# EAGLE design BatteryProtection (EAGLE 9.6.2)
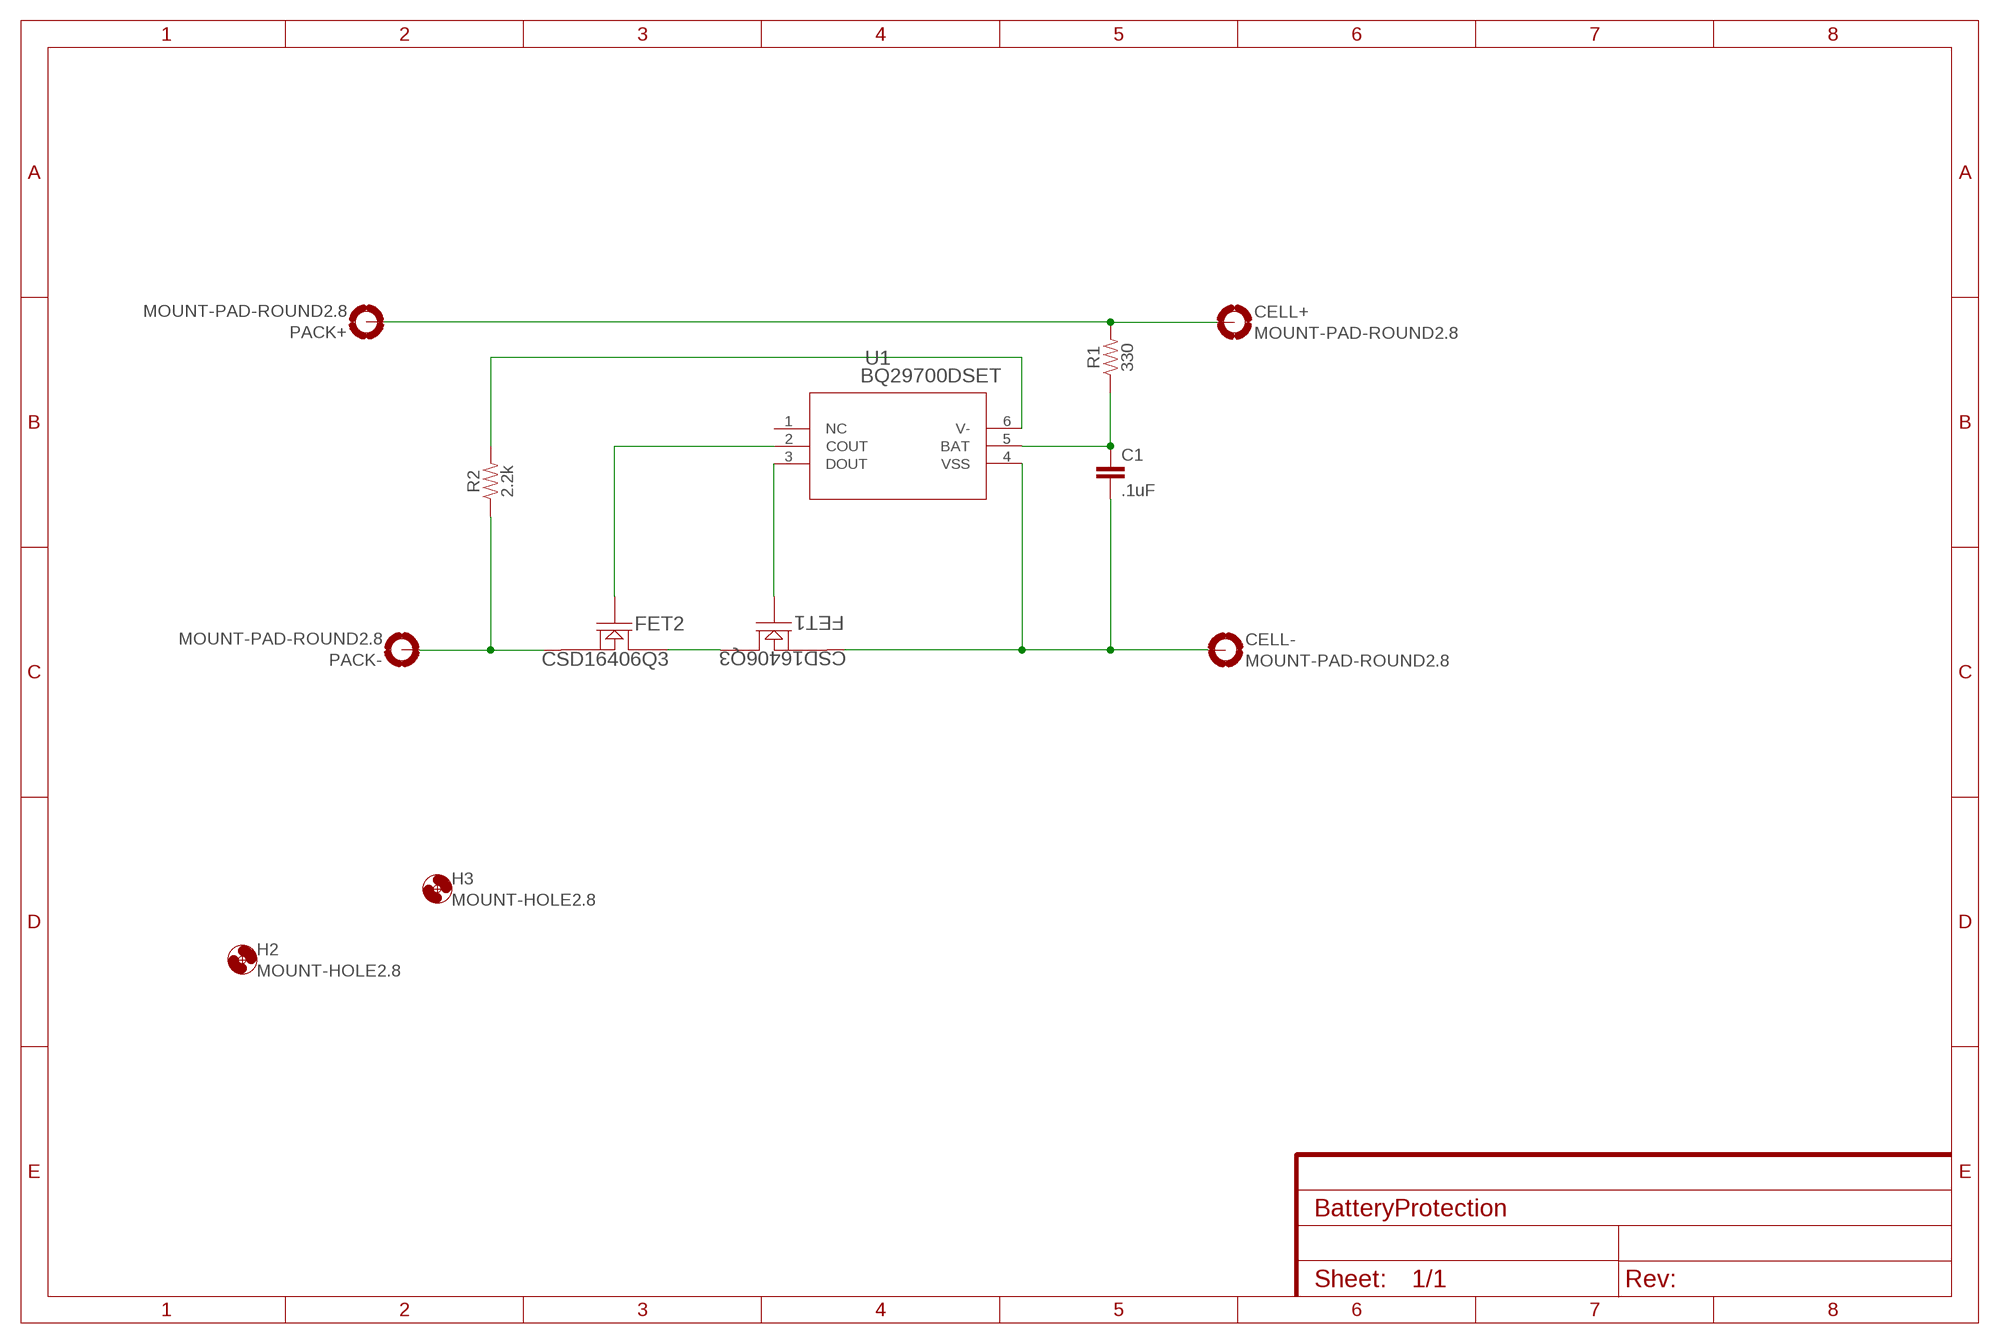
[diagram p0: schematic, sheet 1]

## Parts
C1  .1uF  0.33UF/330NF-0805-50V-10%  [0805]
CELL+  MOUNT-PAD-ROUND2.8  [2,8-PAD]
CELL-  MOUNT-PAD-ROUND2.8  [2,8-PAD]
FET1  CSD16406Q3  [DQG0008A]
FET2  CSD16406Q3  [DQG0008A]
H2  MOUNT-HOLE2.8  [2,8]
H3  MOUNT-HOLE2.8  [2,8]
PACK+  MOUNT-PAD-ROUND2.8  [2,8-PAD]
PACK-  MOUNT-PAD-ROUND2.8  [2,8-PAD]
R1  330  33KOHM-0603-1/10W-1%  [0603]
R2  2.2k  33KOHM-0603-1/10W-1%  [0603]
U1  BQ29700DSET  [DSE6]

## Nets
N$1: C1.1 R1.1 U1.5(BAT)
N$2: FET2.4(GATE) U1.2(COUT)
N$3: C1.2 CELL-.B2,8(MOUNT) FET1.1(SOURCE) U1.4(VSS)
N$4: FET1.5(DRAIN_2) FET2.5(DRAIN_2)
N$5: FET1.4(GATE) U1.3(DOUT)
N$6: R2.2 U1.6(V-)
N$7: CELL+.B2,8(MOUNT) PACK+.B2,8(MOUNT) R1.2
N$8: FET2.1(SOURCE) PACK-.B2,8(MOUNT) R2.1
Unconnected: U1.1(NC)

## Library data of the parts
C1 = SparkFun-Capacitors:0.33UF/330NF: 0.33µF/330nF ceramic capacitors A capacitor is a passive two-terminal electrical component used to store electrical energy temporarily in an electric field.; PROD_ID: CAP-08469; VALUE: 0.33µF
CELL+ CELL- PACK+ PACK- = holes:MOUNT-PAD-ROUND: MOUNTING PAD, round
FET1 FET2 = KRUPS:CSD16406Q3; DATASHEET_URL: http://www.ti.com/lit/ds/symlink/csd16406q3.pdf; IDSMAX: 60.0; MANUFACTURER_PART_NUMBER: CSD16406Q3; QGTYP: 5.8; QUANTITY: 1; RDSON45: 0.0059; VDSMAX: 25.0; VENDOR: Texas Instruments
H2 H3 = holes:MOUNT-HOLE: MOUNTING HOLE with drill center marker
R1 R2 = SparkFun-Resistors:33KOHM: 33kΩ resistor A resistor is a passive two-terminal electrical component that implements electrical resistance as a circuit element. Resistors act to reduce current flow, and, at the same time, act to lower voltage levels within circuits. - Wikipedia; PROD_ID: RES-08416; VALUE: 33k
U1 = KRUPS:BQ29700DSET; BUILT_BY: EMA_UL_Team; MANUFACTURER_PART_NUMBER: BQ29700DSET; VENDOR: Texas Instruments

## Board
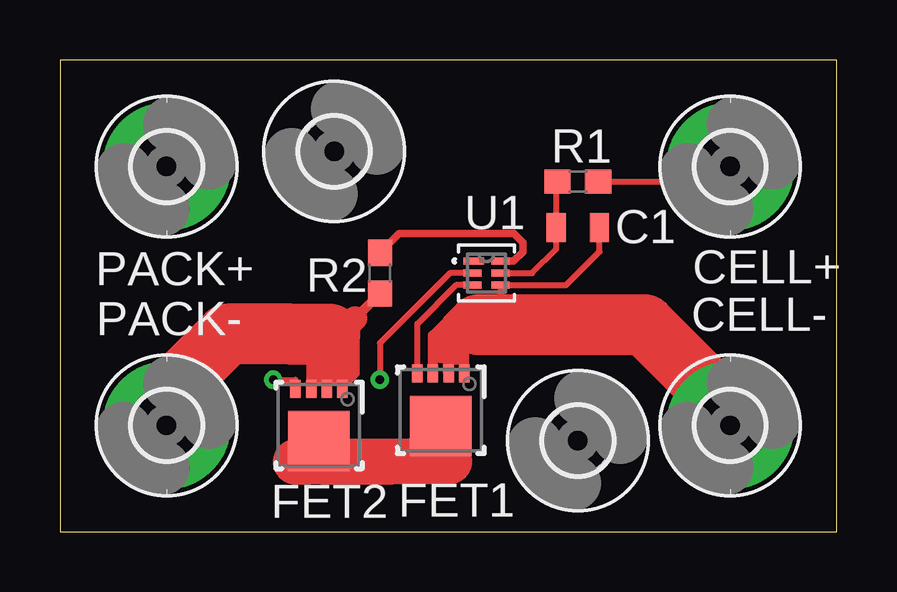
[diagram p1: board, top side]
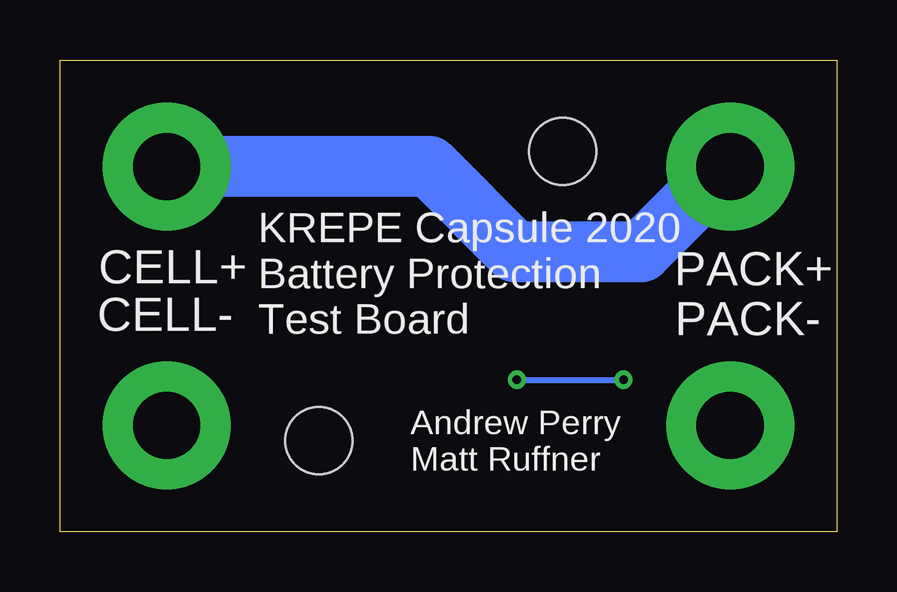
[diagram p2: board, bottom side, seen from below]

Size 32.38 x 19.68 mm. Coordinates in mm from the lower left corner, seen from the top.
Outline: 0,0 32.38,0 32.38,19.68 0,19.68 0,0
Copper layers (1*16): Top 0.035mm / dielectric 1.5mm / Bottom 0.035mm
Design rules "default *": minimum track width 6mil, minimum drill 0.35mm, track to track 6mil, track to pad 6mil, pad to pad 6mil, via to via 6mil, smd to smd 6mil, copper to edge 40mil, drill to drill 6mil, minimum pad ring 10mil, minimum via ring 8mil, stop-mask expansion 4mil, vias tented up to drill 14mil, thermal gap 10mil

### Footprints (pad centres in the part's own frame; a part is rotated, then mirrored left to right if it is on the bottom)
0805 = smd 0.8 x 1.2: 1 -0.9,0; 2 0.9,0
2,8-PAD = drill 2.8 pad 5.334: B2,8 0,0
DQG0008A = smd 0.75 x 0.44: 1 -1.525,0.975; 2 -1.525,0.325; 3 -1.525,-0.325; 4 -1.525,-0.975; 5 1.525,-0.975; 6 1.525,-0.325; 7 1.525,0.325; 8 1.525,0.975 | smd 2.5 x 2.55: 9 0.65,0 | smd 0.5 x 0.5: V 0.226,0.975
2,8 = hole 2.8: 0,0
0603 = smd 1.1 x 1: 1 -0.85,0; 2 0.85,0
DSE6 = smd 0.85 x 0.28: 1 -0.525,0.5 | smd 0.75 x 0.28: 2 -0.575,0; 3 -0.575,-0.5; 4 0.575,-0.5; 5 0.575,0; 6 0.575,0.5

### Placement (x,y rotation side)
C1  21.59,12.7 0 top
CELL+  27.94,15.24 0 top
CELL-  27.94,4.45 0 top
FET1  15.88,5.08 270 top
FET2  10.79,4.45 270 top
H2  11.43,15.88 0 top
H3  21.59,3.81 0 top
PACK+  4.45,15.24 0 top
PACK-  4.45,4.45 0 top
R1  21.59,14.61 0 top
R2  13.34,10.79 90 top
U1  17.78,10.79 0 top

### Tracks (layer width: path | path; a pad name or v marks a point on that pad's centre or on a via)
N$1
  Top 0.254: U1.5 19.68,10.79 20.69,11.8 C1.1 20.69,14.55 R1.1
  Top 0.305: 20.95,12.33 20.95,12.44 C1.1
N$2  (via drill 0.35)
  Top 0.254: U1.2 16.26,10.79 13.34,7.87 v13.34,6.35 | v8.89,6.35 9.82,6.35 FET2.4
  Bottom 0.254: v13.34,6.35 v8.89,6.35
N$3
  Top 0.254: C1.2 22.49,11.7 21.09,10.29 U1.4 18.36,9.54 17.45,8.64
  Top 0.406: 17.45,8.64 16.85,8.04 FET1.1
  Top 2.54: CELL-.B2,8 27.94,5.08 24.38,8.64 17.45,8.64
N$4
  Top 1.016: FET2.5 10.53,2.92 10.96,2.49 13.83,2.49 FET1.5
  Top 1.905: FET2.5 10.3,2.92 10.33,2.94 16.23,2.94 16.23,2.95
N$5
  Top 0.254: U1.3 16.52,10.29 14.9,8.68 FET1.4
N$6
  Top 0.305: U1.6 18.91,11.29 19.3,11.68 19.3,12.06 18.92,12.45 14.14,12.45 R2.2
N$7
  Top 0.254: R1.2 27.3,14.61 CELL+.B2,8
  Bottom 2.54: PACK+.B2,8 4.61,15.24 8.16,11.68 13.43,11.68 16.98,15.24 CELL+.B2,8
N$8
  Top 0.406: FET2.1 11.77,6.1 12.29,6.63 12.29,8.9 R2.1
  Top 1.016: 11.25,8.26 11.64,8.26 12.29,8.9
  Top 2.54: PACK-.B2,8 4.45,5.71 6.99,8.26 9.65,8.26 11.25,8.26
N$9
  Top 0.406: 10.49,5.94 10.49,7.39 10.46,7.42
N$10
  Top 0.406: 11.1,6.38 11.1,7.39 11.18,7.47
N$11
  Top 1.016: 10.79,6.71 10.79,7.44 10.82,7.47
N$12
  Top 1.016: 11.46,6.68 11.46,6.71 11.73,6.99
N$13
  Top 0.406: 16.18,6.6 16.18,8.87 16.56,9.25
N$14
  Top 0.406: 15.54,6.6 15.54,8.2 16.23,8.89
N$15
  Top 1.016: 15.88,7.54 15.88,7.9 15.85,7.92
N$16
  Top 1.016: 16.54,7.49 16.54,8.1

### Text on the board
tNames: PACK+ | CELL+ | PACK- | CELL-
bNames: PACK+ | CELL+ | PACK- | KREPE Capsule 2020 / Battery Protection / Test Board | CELL- | Andrew Perry / Matt Ruffner